# Altium schematic sheet Motherboard.SchDoc
size A; SheetNumber: 1; SheetTotal: 1
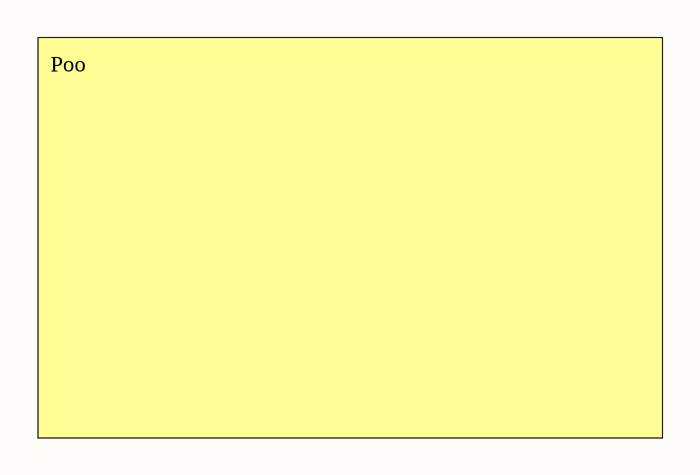
[diagram p0: Motherboard.SchDoc]

## Notes on the sheet
- Poo